# EAGLE design gpx_extend (EAGLE 8.3.1)
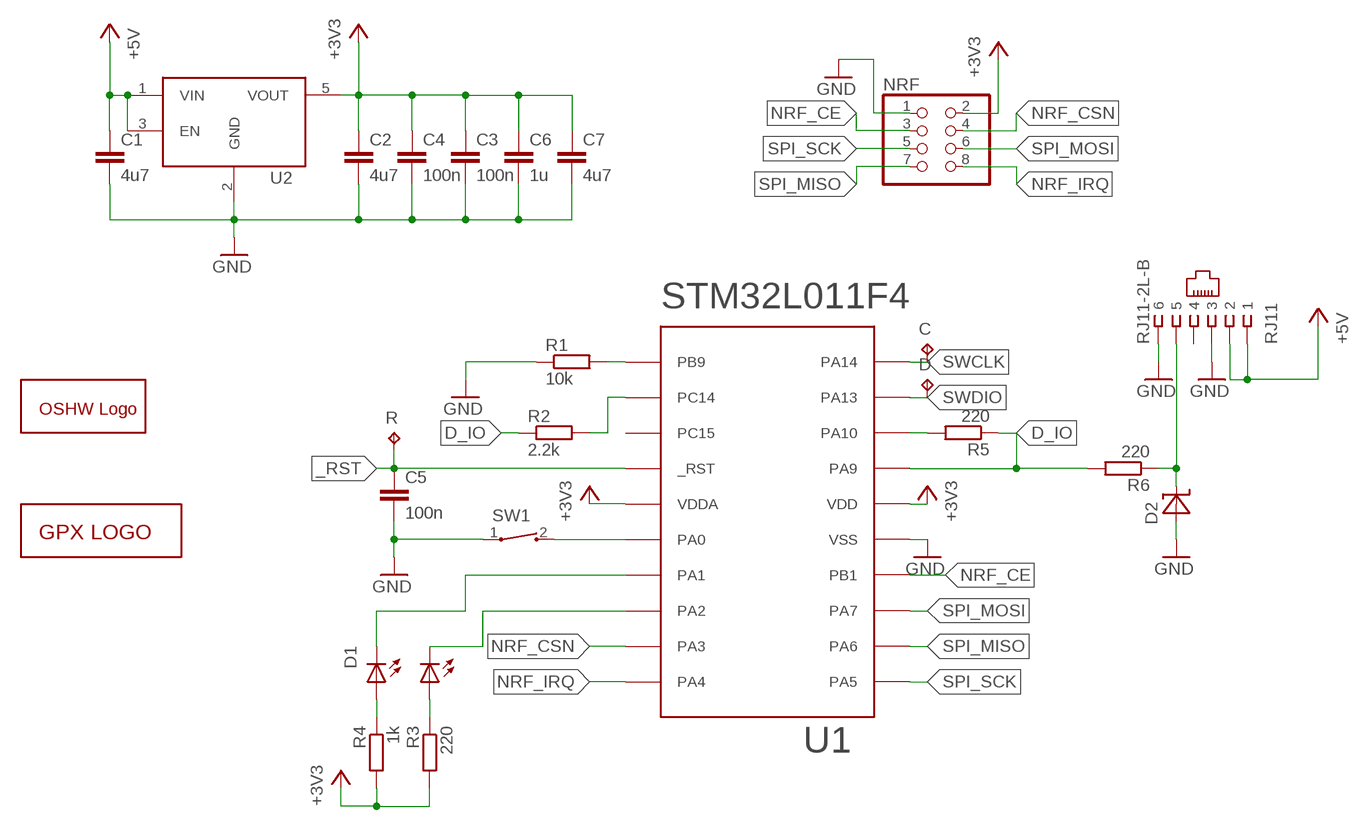
[diagram p0: schematic, sheet 1]

## Parts
C  TPTP10R  [TP10R]
C1  4u7  C-EU-0603  [0603-MMGRID]
C2  4u7  C-EU-0603  [0603-MMGRID]
C3  100n  C-EU-0603  [0603-MMGRID]
C4  100n  C-EU-0603  [0603-MMGRID]
C5  100n  C-EU-0603  [0603-MMGRID]
C6  1u  C-EU-0603  [0603-MMGRID]
C7  4u7  C-EU-0603  [0603-MMGRID]
D  TPTP10R  [TP10R]
D1  LED-DUAL  [LED-1210]
D2  UCLAMP3301HSOD523  [SOD523]
GOLD_ORB_SM1  OSHWLOGOLOGO5MM  [OSHW_5MM]
NRF  PINHD-2X4  [2X04]
R  TPTP10R  [TP10R]
R1  10k  R-EU-0603  [0603-MMGRID]
R2  2.2k  R-EU-0603  [0603-MMGRID]
R3  220  R-EU-0603  [0603-MMGRID]
R4  1k  R-EU-0603  [0603-MMGRID]
R5  220  R-EU-0603  [0603-MMGRID]
R6  220  R-EU-0603  [0603-MMGRID]
RJ11  RJ11-2L-B  [RJ11-NO_SHIELD]
SW1  SW-SPST  [TL3330]
U1  STM32L011F4PX  [TSSOP-20]
U2  MIC550X  [SOT23-5]
U$1  GPX_LOGO  [GPX_LOGO]

## Nets
+3V3: C2.1 C3.1 C4.1 C6.1 C7.1 NRF.2 R3.2 R4.2 U1.P$5(VDDA) U1.P$16(VDD) U2.5(VOUT)
+5V: C1.1 RJ11.1 RJ11.2 U2.1(VIN) U2.3(EN)
_RST: C5.1 R.TP U1.P$4(_RST)
BOOT0: R1.2 U1.P$1(PB9)
BTN: SW1.2 U1.P$6(PA0)
D_IO: R2.1 R5.1 R6.2 U1.P$17(PA9)
GND: C1.2 C2.2 C3.2 C4.2 C5.2 C6.2 C7.2 D2.A NRF.1 R1.1 RJ11.3 RJ11.6 SW1.1 U1.P$15(VSS) U2.2(GND)
N$1: D2.C R6.1 RJ11.5
N$3: D1.1(C0) U1.P$8(PA2)
N$4: D1.3(C1) U1.P$7(PA1)
N$6: D1.2(A0) R3.1
N$7: D1.4(A1) R4.1
NRF_CE: NRF.3 U1.P$14(PB1)
NRF_CSN: NRF.4 U1.P$9(PA3)
NRF_IRQ: NRF.8 U1.P$10(PA4)
PC14: R2.2 U1.P$2(PC14)
RX: R5.2 U1.P$18(PA10)
SPI_MISO: NRF.7 U1.P$12(PA6)
SPI_MOSI: NRF.6 U1.P$13(PA7)
SPI_SCK: NRF.5 U1.P$11(PA5)
SWCLK: C.TP U1.P$20(PA14)
SWDIO: D.TP U1.P$19(PA13)
Unconnected: RJ11.4 U1.P$3(PC15)

## Library data of the parts
C D R = testpad:TP: Test pad
C1-C7 = misc:C-EU
D1 = misc:LED-DUAL
D2 = misc:UCLAMP3301H
GOLD_ORB_SM1 = oshw:OSHWLOGO: The OSHW logo for PCB layout
NRF = pinhead:PINHD-2X4: PIN HEADER
R1-R6 = misc:R-EU
RJ11 = con-tycoelectronics:RJ11: CORCOM Modular RJ Jacks No Shield Source: www.tycoelectronics.com .. ENG_DS_1654001_1099_RJ_L_0507.pdf; MF: TYCO ELECTRONICS; MPN: RJ11-2L-B; OC_FARNELL: unknown; OC_NEWARK: 83F4463
SW1 = misc:SW-SPST
U1 = misc:STM32L011F4
U2 = misc:MIC550X
U$1 = misc:GPX_LOGO

## Board
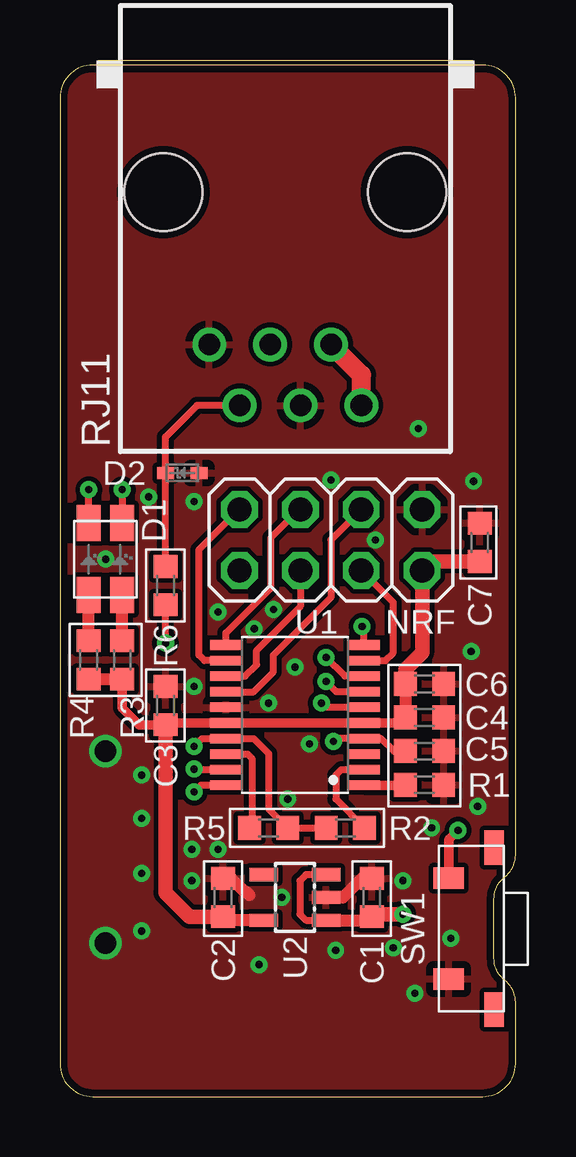
[diagram p1: board, top side]
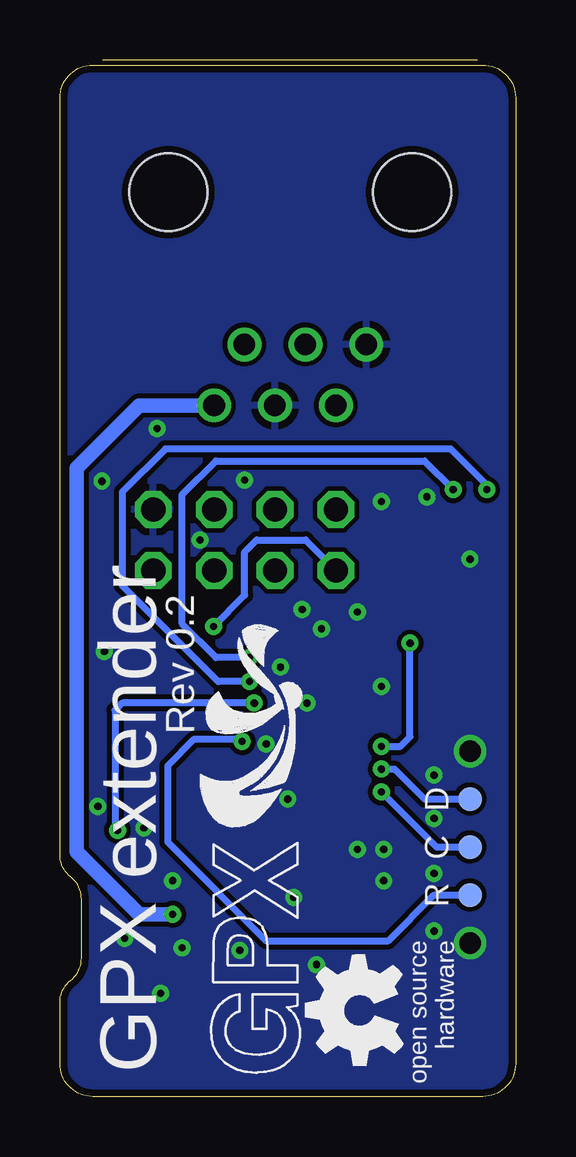
[diagram p2: board, bottom side, seen from below]

Size 19 x 43 mm. Coordinates in mm from the lower left corner, seen from the top.
Outline: 1.37,0 17.63,0 arc90 19,1.37 19,3.93 arc52 18.55,4.85 arc-52 18.1,5.77 18.1,8.23 arc-52 18.55,9.15 arc52 19,10.07 19,41.63 arc90 17.63,43 1.37,43 arc90 0,41.63 0,1.37 arc90 1.37,0
Copper layers (1*16): Top 0.035mm / dielectric 1.5mm / Bottom 0.035mm
Design rules "aisler *": minimum track width 0.1mm, minimum drill 0.3mm, track to track 0.2mm, track to pad 0.2mm, pad to pad 0.2mm, via to via 0.2mm, smd to smd 0.1mm, copper to edge 0.3mm, drill to drill 6mil, minimum pad ring 10mil, minimum via ring 8mil, stop-mask expansion 0.1mm, vias tented up to drill 99mm, thermal gap 0.3mm

### Footprints (pad centres in the part's own frame; a part is rotated, then mirrored left to right if it is on the bottom)
TP10R = smd 1 x 1: TP 0,0
0603-MMGRID = smd 0.95 x 1: 1 -0.8,0; 2 0.8,0
LED-1210 = smd 1.5 x 1: 1 -1.5,0.7; 2 1.5,0.7; 3 -1.5,-0.7; 4 1.5,-0.7
SOD523 = smd 0.7 x 0.5: A 0.7,0; C -0.7,0
2X04 = drill 1.016 octagon: 1 -3.81,-1.27; 2 -3.81,1.27; 3 -1.27,-1.27; 4 -1.27,1.27; 5 1.27,-1.27; 6 1.27,1.27; 7 3.81,-1.27; 8 3.81,1.27
RJ11-NO_SHIELD = drill 0.9 pad 1.4: 1 -3.175,8.89; 2 -1.905,6.35; 3 -0.635,8.89; 4 0.635,6.35; 5 1.905,8.89; 6 3.175,6.35 | hole 3.251: -5.08,0; 5.08,0
TL3330 = smd 0.9 x 1.27: 1 -2.1,0.885; 2 2.1,0.885 | smd 1.45 x 0.8: CH0 3.375,-1; CH1 -3.375,-1
TSSOP-20 = smd 0.4 x 1.35: P$1 -2.925,-2.875; P$2 -2.275,-2.875; P$3 -1.625,-2.875; P$4 -0.975,-2.875; P$5 -0.325,-2.875; P$6 0.325,-2.875; P$7 0.975,-2.875; P$8 1.625,-2.875; P$9 2.275,-2.875; P$10 2.925,-2.875; P$11 2.925,2.875; P$12 2.275,2.875; P$13 1.625,2.875; P$14 0.975,2.875; P$15 0.325,2.875; P$16 -0.325,2.875; P$17 -0.975,2.875; P$18 -1.625,2.875; P$19 -2.275,2.875; P$20 -2.925,2.875
SOT23-5 = smd 0.55 x 1.2: 1 -0.95,-1.3; 2 0,-1.3; 3 0.95,-1.3; 4 0.95,1.3; 5 -0.95,1.3

### Placement (x,y rotation side)
C  1.9,10.4 0 bottom
C1  13,8.3 90 top
C2  6.8,8.3 90 top
C3  4.4,16.3 90 top
C4  15.2,15.8 0 top
C5  15.2,14.4 0 top
C6  15.2,17.2 0 top
C7  17.5,23.1 90 top
D  1.9,12.4 0 bottom
D1  1.9,22.4 270 top
D2  5.1,26 0 top
GOLD_ORB_SM1  6.5,3.6 90 bottom
NRF  11.3,23.2 180 top
R  1.9,8.4 0 bottom
R1  15.2,13 180 top
R2  11.9,11.2 0 top
R3  2.6,18.2 270 top
R4  1.2,18.2 270 top
R5  8.7,11.2 180 top
R6  4.4,21.3 270 top
RJ11  9.4,37.7 180 top
SW1  17.1,7 90 top
U1  9.8,15.9 90 top
U2  9.8,8.3 90 top
U$1  8.9,1 90 bottom

### Tracks (layer width: path | path; a pad name or v marks a point on that pad's centre or on a via)
+3V3
  Top 0.4: C4.1 14.18,15.57 U1.P$5 U1.P$16 4.51,15.57 4.4,15.47 | R3.2 2.6,16.2 3.3,15.5 C3.1
  Top 0.5: R4.2 R3.2 | C6.1 C4.1 | U2.5 6.95,7.35 C2.1
  Top 0.6: C6.1 14.4,17.8 15.11,18.51 NRF.2 15.48,22.3 C7.1 | C2.1 5.4,7.5 4.4,8.5 4.4,15.47 C3.1
+5V  (via drill 0.3)
  Top 0.3: U2.1 10.25,7.35 10,7.6 10,9 10.25,9.25 U2.3
  Top 0.5: U2.1 12.85,7.35 C1.1
  Top 0.6: v14.3,7.6 13.1,7.6 C1.1
  Top 0.8: RJ11.1 12.57,30.08 RJ11.2
  Bottom 0.6: RJ11.1 15.69,28.81 18.3,26.2 18.3,10.2 15.7,7.6 v14.3,7.6
_RST  (via drill 0.3)
  Top 0.3: C5.1 13.92,14.4 13.39,14.93 U1.P$4 11.53,14.93 v11.4,14.8
  Bottom 0.3: 1.9,8.3 R.TP 3.4,8.4 5.3,6.5 10.4,6.5 14.5,10.6 14.5,13.8 13.4,14.9 11.5,14.9 v11.4,14.8
BOOT0
  Top 0.4: U1.P$1 14.38,12.97 R1.2
BTN  (via drill 0.3)
  Top 0.3: U1.P$6 11.07,16.23 v10.9,16.4
  Top 0.4: SW1.2 16.21,10.71 v16.6,11.1
  Bottom 0.3: v10.9,16.4 16.4,16.4 16.7,16.1 16.7,11 v16.6,11.1
D_IO  (via drill 0.3)
  Top 0.3: v5.6,14.6 5.92,14.93 U1.P$17 8.07,14.93 8.7,14.3 8.7,12 R5.1 R2.1 | v4.4,18.9 R6.2
  Bottom 0.3: v5.6,14.6 4.8,14.6 4.4,15 v4.4,18.9
GND  (via drill 0.3, 0.9)
  Top 0.5: 7.9,8.4 7.78,8.53 7.71,8.53 7.14,9.1 C2.2 | U2.2 11.8,8.3 12.6,9.1 C1.2
  other vias: 1.9,22.4 5.6,17.1 3.7,25 8.7,16.4 3.4,13.4 17.15,18.55 9.8,17.9 15.5,11.2 14.3,9 6.6,10.3 5.5,9 14.8,4.3 16.3,6.6 17.42,12.1 5.6,24.8 8.1,19.5 8.9,20.3 6.6,20.2 3.4,9.3 3.4,11.6 8.3,5.5 13.9,6.2 9.25,8.3 11.5,6.1 3.4,6.9 14.95,27.85 17.25,25.65 5.5,10.3 11.3,25.7 13.16,23.2 1.9,6.4 1.9,14.4 10.4,14.7 9.5,12.4
  pour Top: 0,0 18.6,0 18.6,42.9 0,42.9
  pour Bottom: 18.6,0 0,0 0,42.9 18.6,42.9
N$1
  Top 0.3: RJ11.5 5.71,28.81 4.4,27.5 D2.C 4.4,25.29 4.4,24.71 R6.1
N$3  (via drill 0.3)
  Top 0.3: U1.P$8 11.88,17.52 v11.1,18.3 | v2.6,25.3 D1.1
  Bottom 0.3: v11.1,18.3 12.5,18.3 13.9,19.7 13.9,25.1 12.5,26.5 3.8,26.5 v2.6,25.3
N$4  (via drill 0.3)
  Top 0.3: U1.P$7 11.53,16.88 v11.1,17.3 | D1.3 v1.2,25.3
  Bottom 0.3: v11.1,17.3 12.4,17.3 16.4,21.3 16.4,25.2 14.6,27 2.7,27 1.2,25.5 v1.2,25.3
N$6
  Top 0.5: R3.1 D1.2
N$7
  Top 0.5: R4.1 D1.4
NRF_CE
  Top 0.3: NRF.3 11.3,23.2 11.3,20.8 8.9,18.4 8.9,17.7 8.07,16.88 U1.P$14
NRF_CSN
  Top 0.3: NRF.4 13.9,20.6 13.9,18.5 13.57,18.18 U1.P$9
NRF_IRQ  (via drill 0.3)
  Top 0.3: U1.P$10 12.68,19.52 v12.6,19.6
  Bottom 0.3: NRF.8 8.76,23.2 10.8,23.2 11.3,22.7 11.3,20.9 v12.6,19.6
PC14
  Top 0.3: U1.P$2 11.72,13.62 11.5,13.4 11.5,12.4 R2.2
RX
  Top 0.3: U1.P$18 7.83,14.28 8,14.1 8,11.3 R5.2
SPI_MISO
  Top 0.3: NRF.7 7.47,24.47 5.8,22.8 5.8,18.4 6.03,18.18 U1.P$12
SPI_MOSI
  Top 0.3: NRF.6 10.03,20.43 8.2,18.6 8.2,18 7.72,17.52 U1.P$13
SPI_SCK
  Top 0.3: NRF.5 9.97,24.47 8.8,23.3 8.8,21.2 6.92,19.32 U1.P$11
SWCLK  (via drill 0.3)
  Top 0.3: U1.P$20 5.88,12.97 v5.6,12.7
  Bottom 0.3: v5.6,12.7 3.3,10.4 C.TP
SWDIO  (via drill 0.3)
  Top 0.3: U1.P$19 5.62,13.62 v5.6,13.65
  Bottom 0.3: v5.6,13.65 5.05,13.65 3.8,12.4 D.TP

### Text on the board
bPlace: Rev 0.2 | GPX extender